# Altium schematic sheet MainProc.SCHDOC
size B; SheetNumber: 2
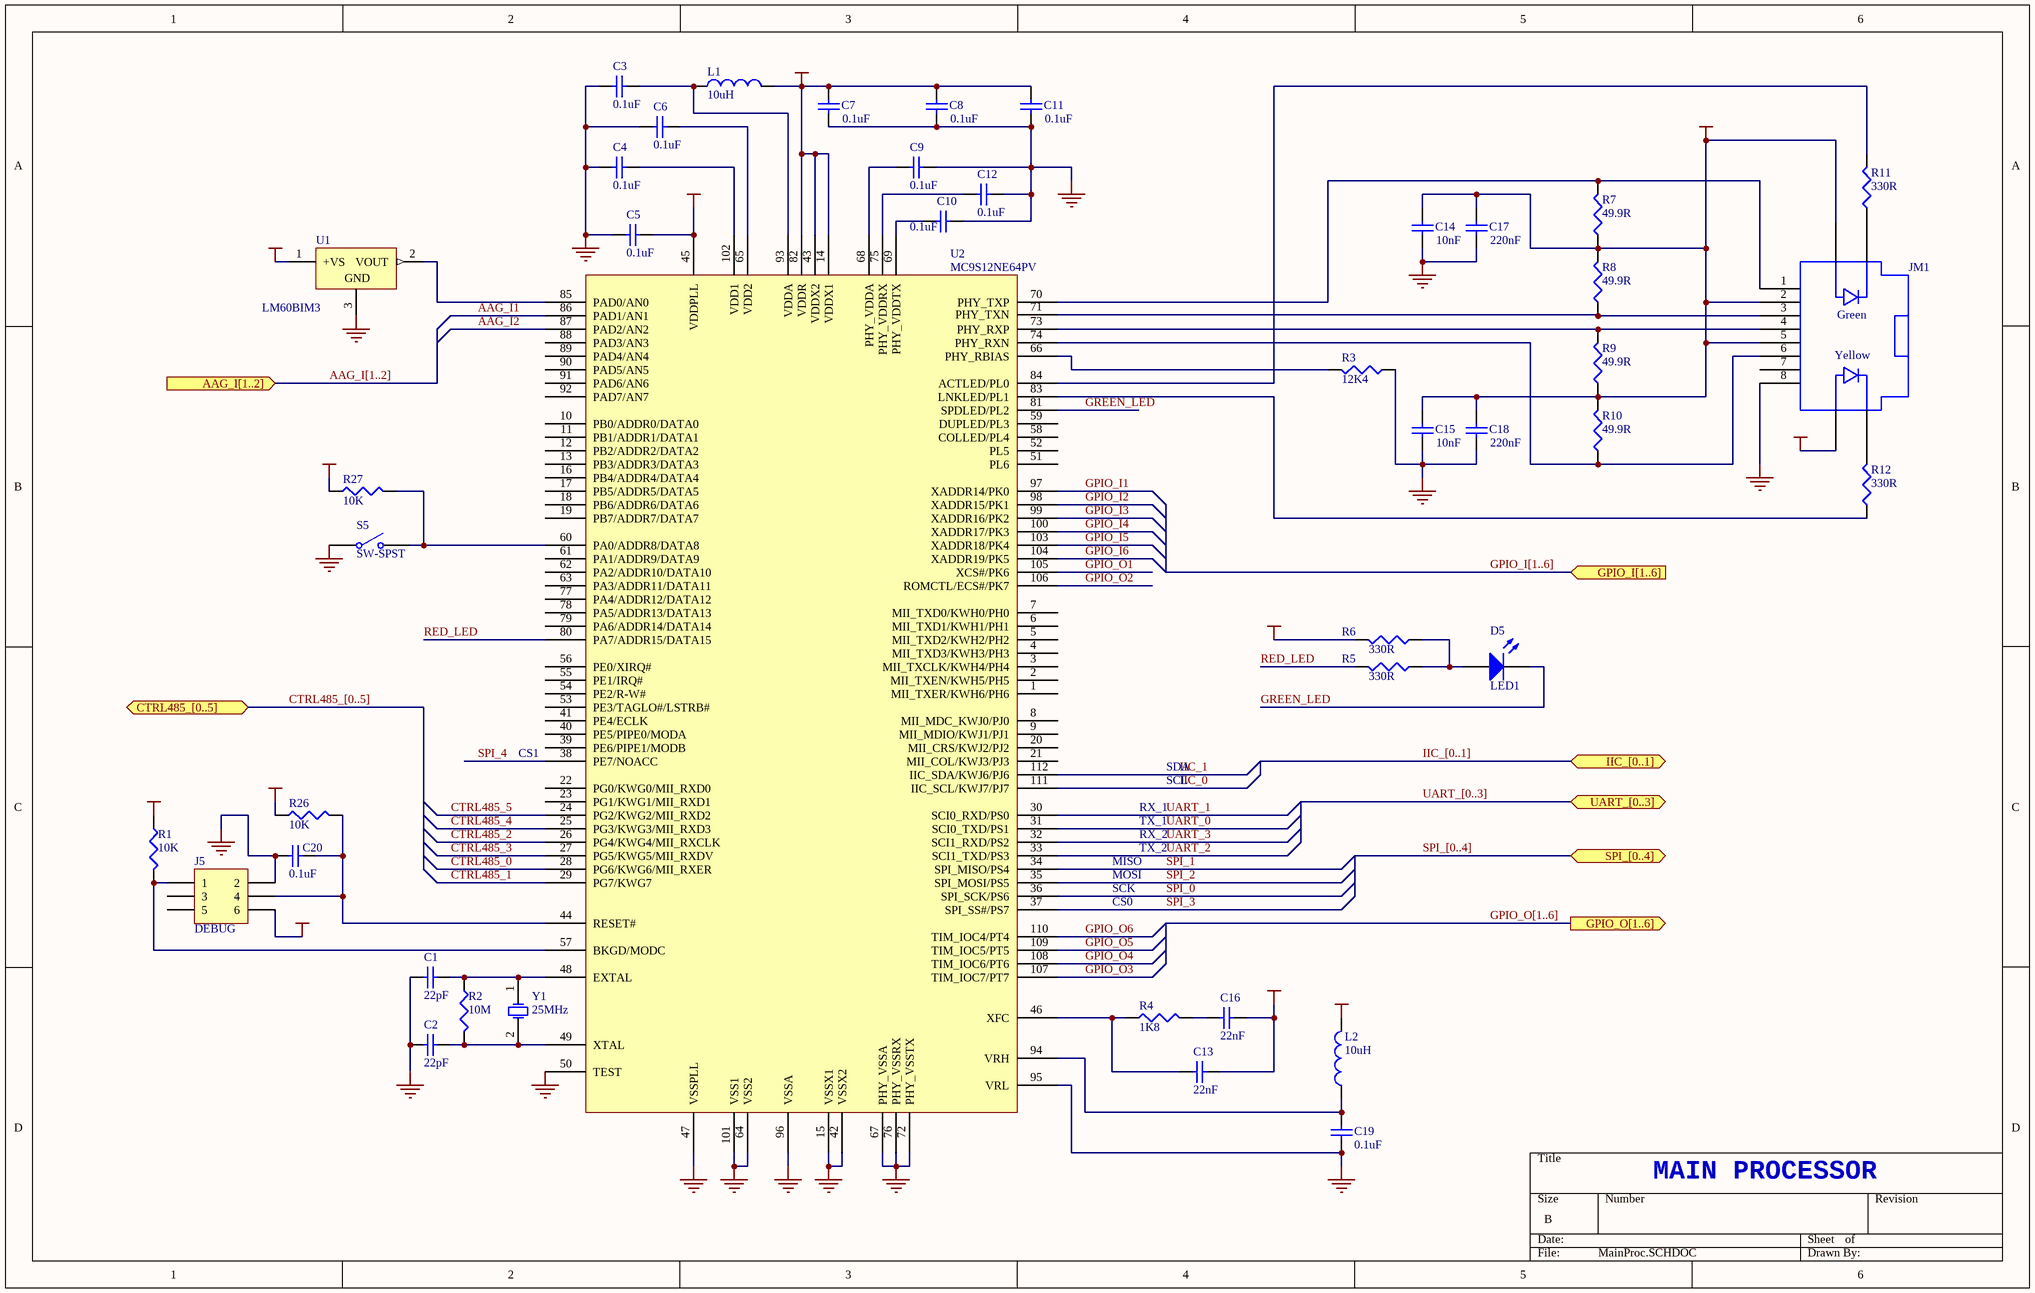
[diagram p0: MainProc.SCHDOC]

## Parts
C1  value 22pF  [_1206]  (hidden comment: Cap Semi)
C2  value 22pF  [_1206]  (hidden comment: Cap Semi)
C3  value 0.1uF  [_0805]  (hidden comment: Cap Semi)
C4  value 0.1uF  [_0805]  (hidden comment: Cap Semi)
C5  value 0.1uF  [_0805]  (hidden comment: Cap Semi)
C6  value 0.1uF  [_0805]  (hidden comment: Cap Semi)
C7  value 0.1uF  [_0805]  (hidden comment: Cap Semi)
C8  value 0.1uF  [_0805]  (hidden comment: Cap Semi)
C9  value 0.1uF  [_0805]  (hidden comment: Cap Semi)
C10  value 0.1uF  [_0805]  (hidden comment: Cap Semi)
C11  value 0.1uF  [_0805]  (hidden comment: Cap Semi)
C12  value 0.1uF  [_0805]  (hidden comment: Cap Semi)
C13  value 22nF  [_0805]  (hidden comment: Cap Semi)
C14  value 10nF  [_0805]  (hidden comment: Cap Semi)
C15  value 10nF  [_0805]  (hidden comment: Cap Semi)
C16  value 22nF  [_0805]  (hidden comment: Cap Semi)
C17  value 220nF  [_0805]  (hidden comment: Cap Semi)
C18  value 220nF  [_0805]  (hidden comment: Cap Semi)
C19  value 0.1uF  [_0805]  (hidden comment: Cap Semi)
C20  value 0.1uF  [_0805]  (hidden comment: Cap Semi)
D5  LED1  [LED_PCB]
J5  DEBUG  [HDR2X3]
JM1  JACK_RJ45_LED  [JACK_RJ45_LEDS]  (value not drawn)
L1  value 10uH  [_0805]  (hidden comment: Inductor)
L2  value 10uH  [_0805]  (hidden comment: Inductor)
R1  value 10K  [_0805]  (hidden comment: Res3)
R2  value 10M  [_1206]  (hidden comment: Res3)
R3  value 12K4  [_0805]  (hidden comment: Res3)
R4  value 1K8  [_0805]  (hidden comment: Res3)
R5  value 330R  [_0805]  (hidden comment: Res3)
R6  value 330R  [_0805]  (hidden comment: Res3)
R7  value 49.9R  [_0805]  (hidden comment: Res3)
R8  value 49.9R  [_0805]  (hidden comment: Res3)
R9  value 49.9R  [_0805]  (hidden comment: Res3)
R10  value 49.9R  [_0805]  (hidden comment: Res3)
R11  value 330R  [_0805]  (hidden comment: Res3)
R12  value 330R  [_0805]  (hidden comment: Res3)
R26  value 10K  [_0805]  (hidden comment: Res3)
R27  value 10K  [_0805]  (hidden comment: Res3)
S5  SW-SPST  [SWITCH]
U1  LM60BIM3  [MA03B]
U2  MC9S12NE64PV  [QFP20x20-G112/Y1.6N]
Y1  value 25MHz  [HC49/4H_SMX]  (hidden comment: XTAL)

## Ports
AAG_I[1..2] (in), CTRL485_[0..5] (bidir), GPIO_I[1..6] (in), GPIO_O[1..6] (out), IIC_[0..1] (bidir), SPI_[0..4] (bidir), UART_[0..3] (bidir)

## Nets
GND: C1.2 C2.2 C3.1 C4.2 C5.2 C6.2 C7.1 C8.1 C9.1 C10.1 C11.1 C12.1 C14.1 C15.1 C17.1 C18.1 C19.1 C20.1 J5.2 JM1.8 R3.1 S5.1(COMMON) U1.3(GND) U2.15(VSSX1) U2.42(VSSX2) U2.47(VSSPLL) U2.50(TEST) U2.64(VSS2) U2.67(PHY_VSSA) U2.72(PHY_VSSTX) U2.76(PHY_VSSRX) U2.95(VRL) U2.96(VSSA) U2.101(VSS1)
VCC_3V: C7.2 C8.2 C11.2 C14.2 C15.2 C17.2 C18.2 J5.6 JM1.2 JM1.5 JM1.GA JM1.YA L1.2 L2.2 R1.1 R6.2 R7.1 R8.2 R9.1 R10.2 R26.1 R27.1 U1.1(+VS) U2.14(VDDX1) U2.43(VDDX2) U2.82(VDDR)
VDD_PLL: C5.1 C13.1 C16.1 U2.45(VDDPLL)
AAG_I1: U2.86(PAD1/AN1)
AAG_I2: U2.87(PAD2/AN2)
CTRL485_0: U2.28(PG6/KWG6/MII_RXER)
CTRL485_1: U2.29(PG7/KWG7)
CTRL485_2: U2.26(PG4/KWG4/MII_RXCLK)
CTRL485_3: U2.27(PG5/KWG5/MII_RXDV)
CTRL485_4: U2.25(PG3/KWG3/MII_RXD3)
CTRL485_5: U2.24(PG2/KWG2/MII_RXD2)
GPIO_I1: U2.97(XADDR14/PK0)
GPIO_I2: U2.98(XADDR15/PK1)
GPIO_I3: U2.99(XADDR16/PK2)
GPIO_I4: U2.100(XADDR17/PK3)
GPIO_I5: U2.103(XADDR18/PK4)
GPIO_I6: U2.104(XADDR19/PK5)
GPIO_O1: U2.105(XCS#/PK6)
GPIO_O2: U2.106(ROMCTL/ECS#/PK7)
GPIO_O3: U2.107(TIM_IOC7/PT7)
GPIO_O4: U2.108(TIM_IOC6/PT6)
GPIO_O5: U2.109(TIM_IOC5/PT5)
GPIO_O6: U2.110(TIM_IOC4/PT4)
GREEN_LED: D5.2(K) U2.81(SPDLED/PL2)
IIC_0: U2.111(IIC_SCL/KWJ7/PJ7)
IIC_1: U2.112(IIC_SDA/KWJ6/PJ6)
RED_LED: R5.2 U2.80(PA7/ADDR15/DATA15)
SPI_0: U2.36(SPI_SCK/PS6)
SPI_1: U2.34(SPI_MISO/PS4)
SPI_2: U2.35(SPI_MOSI/PS5)
SPI_3: U2.37(SPI_SS#/PS7)
SPI_4: U2.38(PE7/NOACC)
UART_0: U2.31(SCI0_TXD/PS1)
UART_1: U2.30(SCI0_RXD/PS0)
UART_2: U2.33(SCI1_TXD/PS3)
UART_3: U2.32(SCI1_RXD/PS2)
NetC1_1: C1.1 R2.1 U2.48(EXTAL) Y1.1(OSC1)
NetC2_1: C2.1 R2.2 U2.49(XTAL) Y1.2(OSC2)
NetC3_2: C3.2 L1.1 U2.93(VDDA)
NetC4_1: C4.1 U2.102(VDD1)
NetC6_1: C6.1 U2.65(VDD2)
NetC9_2: C9.2 U2.68(PHY_VDDA)
NetC10_2: C10.2 U2.69(PHY_VDDTX)
NetC12_2: C12.2 U2.75(PHY_VDDRX)
NetC13_2: C13.2 R4.1 U2.46(XFC)
NetC16_2: C16.2 R4.2
NetC19_2: C19.2 L2.1 U2.94(VRH)
NetC20_2: C20.2 J5.4 R26.2 U2.44(RESET#)
NetD5_1: D5.1(A) R5.1 R6.1
NetJ5_1: J5.1 R1.2 U2.57(BKGD/MODC)
NetJM1_1: JM1.1 R7.2 U2.70(PHY_TXP)
NetJM1_3: JM1.3 R8.1 U2.71(PHY_TXN)
NetJM1_4: JM1.4 R9.2 U2.73(PHY_RXP)
NetJM1_6: JM1.6 R10.1 U2.74(PHY_RXN)
NetJM1_GK: JM1.GK R11.1
NetJM1_YK: JM1.YK R12.2
NetR3_2: R3.2 U2.66(PHY_RBIAS)
NetR11_2: R11.2 U2.84(ACTLED/PL0)
NetR12_1: R12.1 U2.83(LNKLED/PL1)
NetR27_2: R27.2 S5.2(NO) U2.60(PA0/ADDR8/DATA8)
NetU1_2: U1.2(VOUT) U2.85(PAD0/AN0)

Not connected (* = marked no-connect by the designer): J5 3 5; JM1 7; U2 1(MII_TXER/KWH6/PH6) 2(MII_TXEN/KWH5/PH5) 3(MII_TXCLK/KWH4/PH4) 4(MII_TXD3/KWH3/PH3) 5(MII_TXD2/KWH2/PH2) 6(MII_TXD1/KWH1/PH1) 7(MII_TXD0/KWH0/PH0) 8(MII_MDC_KWJ0/PJ0) 9(MII_MDIO/KWJ1/PJ1) 10(PB0/ADDR0/DATA0) 11(PB1/ADDR1/DATA1) 12(PB2/ADDR2/DATA2) 13(PB3/ADDR3/DATA3) 16(PB4/ADDR4/DATA4) 17(PB5/ADDR5/DATA5) 18(PB6/ADDR6/DATA6) 19(PB7/ADDR7/DATA7) 20(MII_CRS/KWJ2/PJ2) 21(MII_COL/KWJ3/PJ3) 22(PG0/KWG0/MII_RXD0) 23(PG1/KWG1/MII_RXD1) 39(PE6/PIPE1/MODB) 40(PE5/PIPE0/MODA) 41(PE4/ECLK) 51(PL6) 52(PL5) 53(PE3/TAGLO#/LSTRB#) 54(PE2/R-W#) 55(PE1/IRQ#) 56(PE0/XIRQ#) 58(COLLED/PL4) 59(DUPLED/PL3) 61(PA1/ADDR9/DATA9) 62(PA2/ADDR10/DATA10) 63(PA3/ADDR11/DATA11) 77(PA4/ADDR12/DATA12) 78(PA5/ADDR13/DATA13) 79(PA6/ADDR14/DATA14) 88(PAD3/AN3) 89(PAD4/AN4) 90(PAD5/AN5) 91(PAD6/AN6) 92(PAD7/AN7)

## Buses and harness runs
bus AAG_I[1..2] = port AAG_I[1..2]
bus CTRL485_[0..5] = port CTRL485_[0..5]
bus GPIO_I[1..6] = port GPIO_I[1..6]
bus GPIO_O[1..6] = port GPIO_O[1..6]
bus IIC_[0..1] = port IIC_[0..1]
bus SPI_[0..4] = port SPI_[0..4]
bus UART_[0..3] = port UART_[0..3]

## Notes on the sheet
- (near U2) CS1
- SDA
- RX_2
- TX_1
- RX_1
- SCL
- SCK
- MISO
- MOSI
- CS0
- TX_2
- MAIN PROCESSOR
- (in symbol JACK_RJ45_LED) Green; Yellow

## Library data of the parts
C1-C20 = Cap Semi: Capacitor (Semiconductor SIM Model); Published: 8-Jun-2000; Revision: July-2002: Re-released for DXP Platform.; Publisher: Altium Limited
D5 = LED1: Typical RED GaAs LED; Published: 8-Jun-2000; Revision: July-2002: Re-released for DXP Platform.; Publisher: Altium Limited
J5 = Header 3X2: Header, 3-Pin, Dual row; Revision: 17-Jul-2002: Re-released for DXP Platform.; Publisher: Altium Limited
JM1 = JACK_RJ45_LED: RJ45 Connector Jack with Leds
R1-R12 R26 R27 = Res3: Resistor; Published: 8-Jun-2000; Revision: July-2002: Re-released for DXP Platform.; Publisher: Altium Limited
S5 = SW-SPST: Single-Pole, Single-Throw Switch; Published: 24-Mar-1999; Revision: July-2002: Re-released for DXP Platform.; Publisher: Altium Limited
U1 = LM60BIM3: 2.7V, SOT-23 Temperature Sensor; Package Information: Latest Revision: 2000; Published: 15-Apr-2002; Datasheet: Latest Revision: May-1998; Package Reference: MA03B; Publisher: Altium Limited
U2 = MC9S12NE64PV: Integrated Ethernet Controller
Y1 = XTAL: Crystal Oscillator; Published: 8-Jun-2000; Revision: July-2002: Re-released for DXP Platform.; Publisher: Altium Limited
L1 L2 = Inductor: Published: 8-Jun-2000; Revision: July-2002: Re-released for DXP Platform.; Publisher: Altium Limited